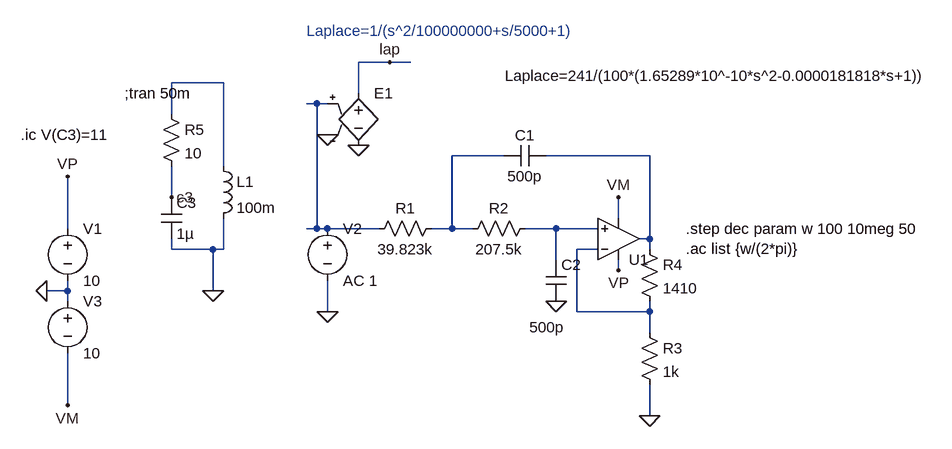
[diagram p0: schematic butterworth_GAIN.asc]
butterworth_GAIN.asc, the LTspice schematic file:
Version 4
SHEET 1 880 728
WIRE -80 112 -128 112
WIRE -48 112 -80 112
WIRE -336 144 -416 144
WIRE -128 160 -128 112
WIRE -192 176 -208 176
WIRE -176 176 -192 176
WIRE -416 192 -416 144
WIRE 96 256 16 256
WIRE 320 256 160 256
WIRE -336 272 -336 144
WIRE -416 320 -416 272
WIRE 272 352 272 320
WIRE -576 368 -576 288
WIRE -192 368 -192 176
WIRE -192 368 -208 368
WIRE -176 368 -192 368
WIRE -96 368 -176 368
WIRE 16 368 16 256
WIRE 16 368 -16 368
WIRE 48 368 16 368
WIRE 176 368 128 368
WIRE 240 368 176 368
WIRE 320 384 320 256
WIRE 320 384 304 384
WIRE -416 400 -416 384
WIRE -352 400 -416 400
WIRE -336 400 -336 352
WIRE -336 400 -352 400
WIRE 240 400 208 400
WIRE 320 400 320 384
WIRE 176 416 176 368
WIRE 272 432 272 416
WIRE -576 464 -576 448
WIRE -576 464 -608 464
WIRE -352 464 -352 400
WIRE -576 480 -576 464
WIRE -176 496 -176 448
WIRE 208 496 208 400
WIRE 320 496 320 480
WIRE 320 496 208 496
WIRE 320 528 320 496
WIRE -576 640 -576 560
WIRE 320 656 320 608
FLAG -176 496 0
FLAG -608 464 0
FLAG 176 480 0
FLAG -576 288 VP
FLAG -576 640 VM
FLAG 272 432 VP
FLAG 272 320 VM
FLAG -128 240 0
FLAG -176 224 0
FLAG -80 112 lap
FLAG 320 656 0
FLAG -352 464 0
FLAG -416 320 c3
SYMBOL Opamps\\UniversalOpamp2 272 384 M180
SYMATTR InstName U1
SYMBOL voltage -576 352 R0
WINDOW 123 0 0 Left 2
WINDOW 39 0 0 Left 2
SYMATTR InstName V1
SYMATTR Value 10
SYMBOL voltage -176 352 R0
WINDOW 123 24 132 Left 2
WINDOW 39 0 0 Left 2
SYMATTR InstName V2
SYMATTR Value AC 1
SYMBOL voltage -576 464 R0
WINDOW 123 0 0 Left 2
WINDOW 39 0 0 Left 2
SYMATTR InstName V3
SYMATTR Value 10
SYMBOL res 0 352 R90
WINDOW 0 0 56 VBottom 2
WINDOW 3 32 56 VTop 2
SYMATTR InstName R1
SYMATTR Value 39.823k
SYMBOL res 144 352 R90
WINDOW 0 0 56 VBottom 2
WINDOW 3 32 56 VTop 2
SYMATTR InstName R2
SYMATTR Value 207.5k
SYMBOL cap 160 416 R0
WINDOW 3 -25 104 Left 2
SYMATTR Value 500p
SYMATTR InstName C2
SYMBOL cap 160 240 R90
WINDOW 0 0 32 VBottom 2
WINDOW 3 32 32 VTop 2
SYMATTR InstName C1
SYMATTR Value 500p
SYMBOL res 304 384 R0
SYMATTR InstName R4
SYMATTR Value 1410
SYMBOL res 304 512 R0
SYMATTR InstName R3
SYMATTR Value 1k
SYMBOL e -128 144 R0
WINDOW 3 225 -11 Left 2
SYMATTR Value Laplace=241/(100*(1.65289*10^-10*s^2-0.0000181818*s+1))
SYMATTR InstName E1
SYMBOL cap -432 320 R0
SYMATTR InstName C3
SYMATTR Value 1µ
SYMBOL res -432 176 R0
SYMATTR InstName R5
SYMATTR Value 10
SYMBOL ind -352 256 R0
SYMATTR InstName L1
SYMATTR Value 100m
TEXT 376 368 Left 2 !.step dec param w 100 10meg 50\n.ac list {w/(2*pi)}
TEXT -208 64 Left 2 ;Laplace=1/(s^2/100000000+s/5000+1)
TEXT -488 160 Left 2 !;tran 50m
TEXT -648 224 Left 2 !.ic V(C3)=11

The netlist it stands for:
* butterworth_GAIN.asc
XU1 N005 N006 VP VM N004 level.2 Avol=1Meg GBW=10Meg Slew=10Meg ilimit=25m rail=0 Vos=0 phimargin=45 en=0 enk=0 in=0 ink=0 Rin=500Meg  ; pins IN+ IN- V+ V- OUT
V1 VP 0 10
V2 N002 0 AC 1
V3 0 VM 10
R1 N003 N002 39.823k
R2 N005 N003 207.5k
C2 N005 0 500p
C1 N004 N003 500p
R4 N004 N006 1410
R3 N006 0 1k
E1 lap 0 N002 0 Laplace=241/(100*(1.65289*10^-10*s^2-0.0000181818*s+1))
C3 c3 0 1µ
R5 N001 c3 10
L1 N001 0 100m
.step dec param w 100 10meg 50
.ac list {w/(2*pi)}
* Laplace=1/(s^2/100000000+s/5000+1)
;tran 50m
.ic V(C3)=11
.lib UniversalOpamps2.sub
.backanno
.end